# Altium schematic sheet Top_level.SchDoc: Top Level
size A4; DocumentNumber: 1; SheetNumber: 1; SheetTotal: 8
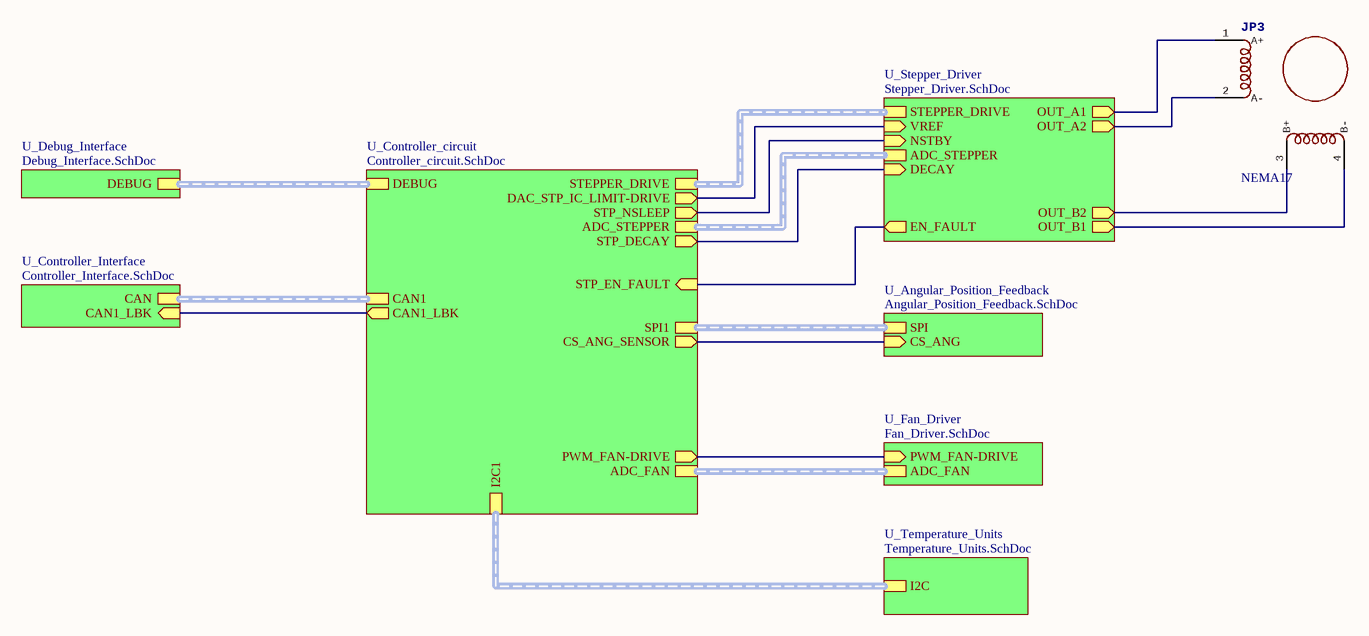
[diagram p0: Top_level.SchDoc]

## Parts
JP3  NEMA17  [S4B-PH-SM4-TB(LF)(SN)]

## Sub-sheets
U_Angular_Position_Feedback = Angular_Position_Feedback.SchDoc: SPI (harness SPI_Harness), CS_ANG (in)
U_Controller_circuit = Controller_circuit.SchDoc: DEBUG (harness Debug_Harness), I2C1 (harness I2C_Harness), CAN1 (harness CAN_Harness), ADC_STEPPER (harness ADC_STEPPER), ADC_FAN (harness ADC_FAN), STEPPER_DRIVE (harness STEPPER_DRIVE), PWM_FAN-DRIVE (out), SPI1 (harness SPI_Harness), DAC_STP_IC_LIMIT-DRIVE (out), STP_EN_FAULT (in), STP_NSLEEP (out), CS_ANG_SENSOR (out), CAN1_LBK (out), STP_DECAY (out)
U_Controller_Interface = Controller_Interface.SchDoc: CAN (harness CAN_Harness), CAN1_LBK (in)
U_Debug_Interface = Debug_Interface.SchDoc: DEBUG (harness Debug_Harness)
U_Fan_Driver = Fan_Driver.SchDoc: PWM_FAN-DRIVE (in), ADC_FAN (harness ADC_FAN)
U_Stepper_Driver = Stepper_Driver.SchDoc: STEPPER_DRIVE (harness STEPPER_DRIVE), VREF (in), NSTBY (in), ADC_STEPPER (harness ADC_STEPPER), OUT_A1 (out), OUT_A2 (out), OUT_B2 (out), OUT_B1 (out), EN_FAULT (out), DECAY (in)
U_Temperature_Units = Temperature_Units.SchDoc: I2C (harness I2C_Harness)

## Nets
NetJP3_1: JP3.1(A+) ; sheet U_Stepper_Driver/OUT_A1
NetJP3_2: JP3.2(A-) ; sheet U_Stepper_Driver/OUT_A2
NetJP3_3: JP3.3(B+) ; sheet U_Stepper_Driver/OUT_B2
NetJP3_4: JP3.4(B-) ; sheet U_Stepper_Driver/OUT_B1
(unnamed): sheet U_Controller_circuit/PWM_FAN-DRIVE, sheet U_Fan_Driver/PWM_FAN-DRIVE
(unnamed): sheet U_Controller_circuit/DAC_STP_IC_LIMIT-DRIVE, sheet U_Stepper_Driver/VREF
(unnamed): sheet U_Controller_circuit/STP_EN_FAULT, sheet U_Stepper_Driver/EN_FAULT
(unnamed): sheet U_Controller_circuit/STP_NSLEEP, sheet U_Stepper_Driver/NSTBY
(unnamed): sheet U_Controller_circuit/CS_ANG_SENSOR, sheet U_Angular_Position_Feedback/CS_ANG
(unnamed): sheet U_Controller_circuit/CAN1_LBK, sheet U_Controller_Interface/CAN1_LBK
(unnamed): sheet U_Controller_circuit/STP_DECAY, sheet U_Stepper_Driver/DECAY

## Buses and harness runs
harness sheet U_Angular_Position_Feedback/SPI = sheet U_Controller_circuit/SPI1
harness sheet U_Controller_circuit/ADC_FAN = sheet U_Fan_Driver/ADC_FAN
harness sheet U_Controller_circuit/ADC_STEPPER = sheet U_Stepper_Driver/ADC_STEPPER
harness sheet U_Controller_circuit/CAN1 = sheet U_Controller_Interface/CAN
harness sheet U_Controller_circuit/DEBUG = sheet U_Debug_Interface/DEBUG
harness sheet U_Controller_circuit/I2C1 = sheet U_Temperature_Units/I2C
harness sheet U_Controller_circuit/STEPPER_DRIVE = sheet U_Stepper_Driver/STEPPER_DRIVE

## Notes on the sheet
- Title
- Size:
- Date:
- A4
- Number:
- Time:
- Revision:
- Sheet
- of
- File:

## Library data of the parts
JP3 = NEMA17: Stepper Motor